# Altium schematic sheet Actuators.SchDoc
size A; DocumentNumber: 4; SheetNumber: 4; SheetTotal: 5
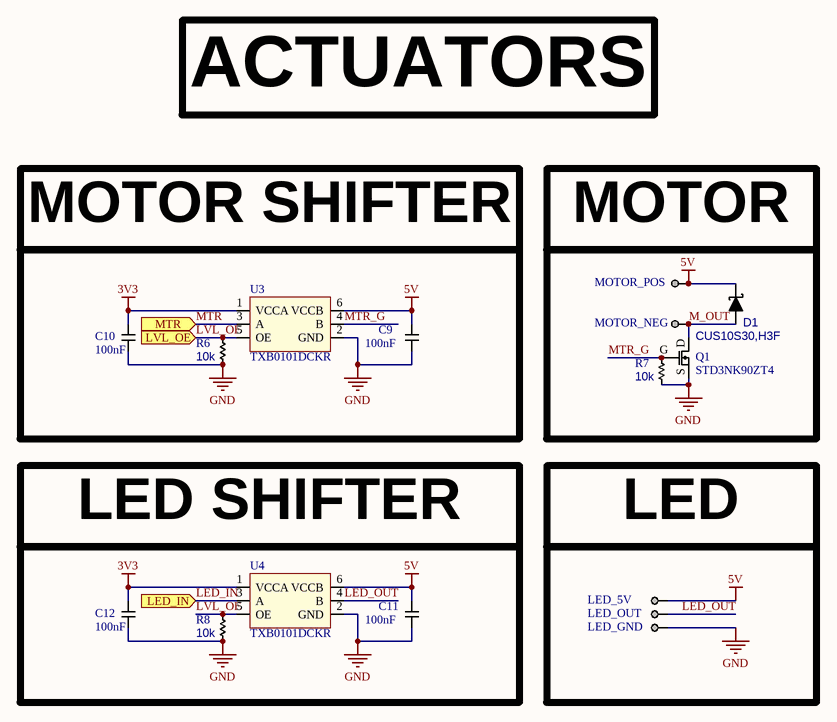
[diagram p0: Actuators.SchDoc]

## Parts
C9  100nF  [CAP_0402_HIGH]
C10  100nF  [CAP_0402_HIGH]
C11  100nF  [CAP_0402_HIGH]
C12  100nF  [CAP_0402_HIGH]
D1  CUS10S30,H3F  [CUS10S30,H3F]
LED_5V  18 AWG Hole  [18 AWG Hole]  (value not drawn)  (no BOM)
LED_GND  18 AWG Hole  [18 AWG Hole]  (value not drawn)  (no BOM)
LED_OUT  18 AWG Hole  [18 AWG Hole]  (value not drawn)  (no BOM)
MOTOR_NEG  18 AWG Hole  [18 AWG Hole]  (value not drawn)  (no BOM)
MOTOR_POS  18 AWG Hole  [18 AWG Hole]  (value not drawn)  (no BOM)
Q1  STD3NK90ZT4  [STD3NK90ZT4]
R6  10k  [RES_0402_HIGH]
R7  10k  [RES_0402_HIGH]
R8  10k  [RES_0402_HIGH]
U3  TXB0101DCKR  [TXB0101DCKR]
U4  TXB0101DCKR  [TXB0101DCKR]

## Ports
LED_IN (in), LVL_OE (in), MTR (in)

## Nets
3V3: C10.2 C12.2 U3.1(VCCA) U4.1(VCCA)
5V: C9.2 C11.2 D1.1 LED_5V.1 MOTOR_POS.1 U3.6(VCCB) U4.6(VCCB)
GND: C9.1 C10.1 C11.1 C12.1 LED_GND.1 Q1.S R6.1 R7.1 R8.1 U3.2(GND) U4.2(GND)
LED_IN: U4.3(A) ; port LED_IN
LED_OUT: LED_OUT.1 U4.4(B)
LVL_OE: R6.2 R8.2 U3.5(OE) U4.5(OE) ; port LVL_OE
M_OUT: D1.2 MOTOR_NEG.1 Q1.D
MTR: U3.3(A) ; port MTR
MTR_G: Q1.G R7.2 U3.4(B)

## Notes on the sheet
- ACTUATORS
- MOTOR SHIFTER
- MOTOR
- LED SHIFTER
- LED

## Library data of the parts
C9-C12 = Capacitor_0402: 0402 Capacitor
D1 = CUS10S30,H3F: CUS10S30,H3F Diode Schottky 30V 1A Surface Mount USC
Q1 = STD3NK90ZT4: STD3NK90ZT4 N-Channel 900 V 3A (Tc) 90W (Tc) Surface Mount DPAK
R6-R8 = Resistor_0402: 0402 Resistor
U3 U4 = TXB0101DCKR: TXB0101DCKR Voltage Level Translator Bidirectional 1 Circuit 1 Channel 100Mbps SC-70-6